# EAGLE design schematic (EAGLE 8.2.2)
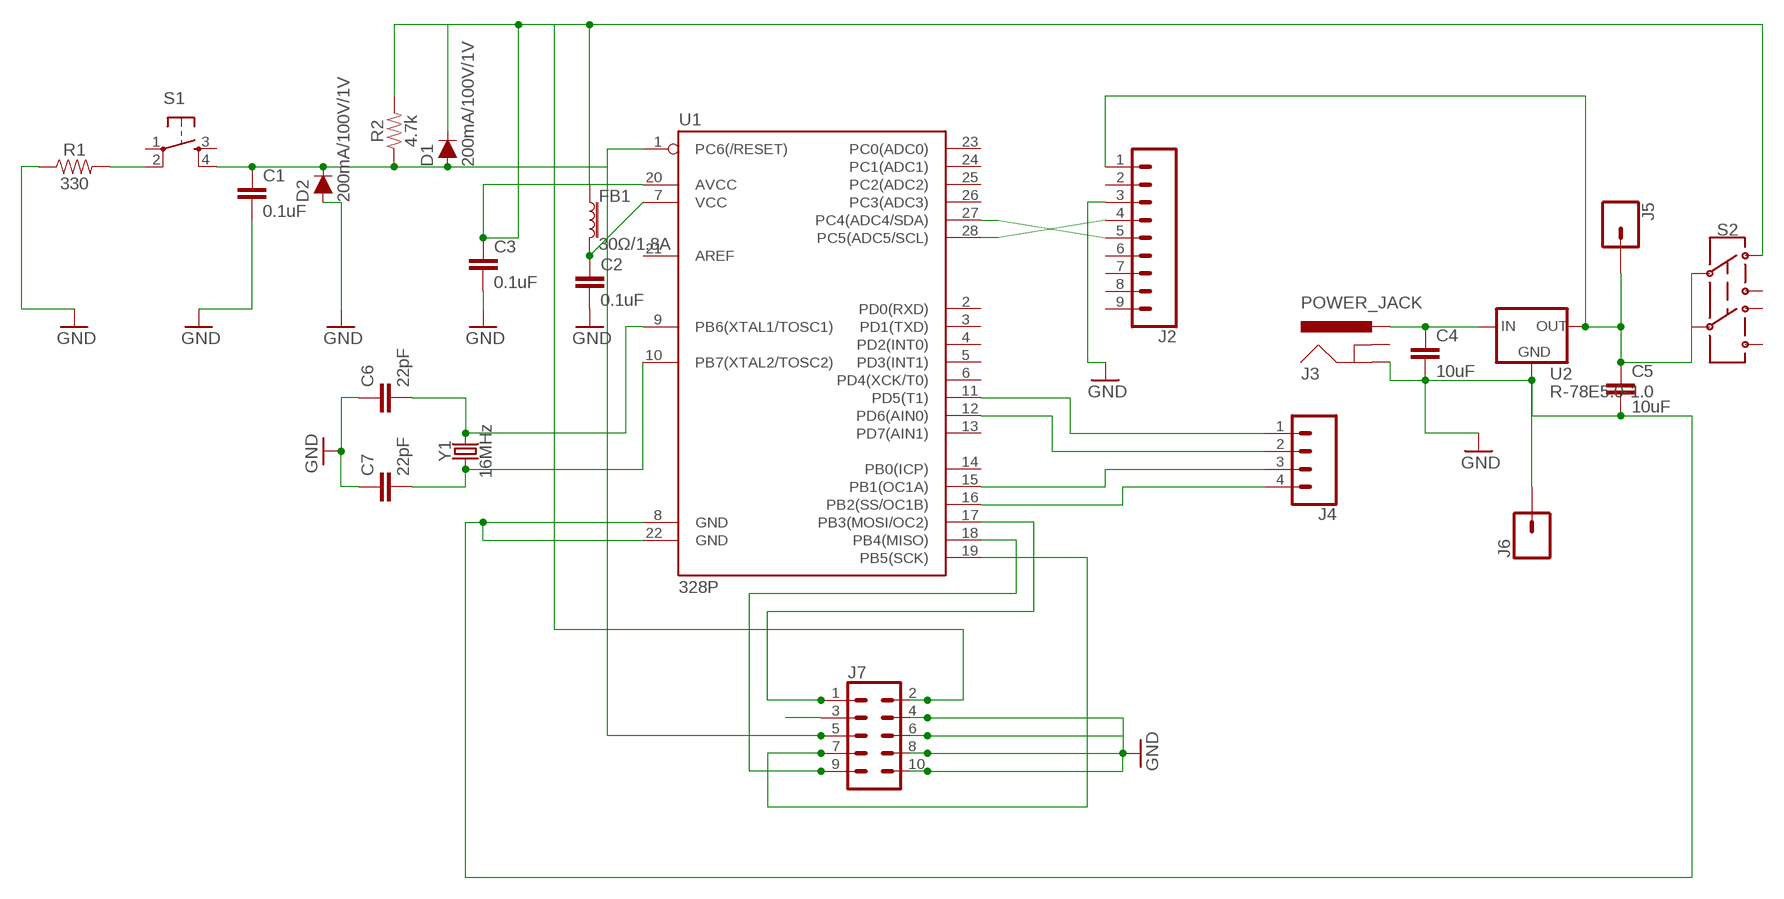
[diagram p0: schematic, sheet 1]

## Parts
C1  0.1uF  0.1UF-0603-25V-(+80/-20%)  [0603]
C2  0.1uF  0.1UF-0603-25V-(+80/-20%)  [0603]
C3  0.1uF  0.1UF-0603-25V-(+80/-20%)  [0603]
C4  10uF  10UF-0603-6.3V-20%  [0603]
C5  10uF  10UF-0603-6.3V-20%  [0603]
C6  22pF  22PF-0603-50V-5%  [0603]
C7  22pF  22PF-0603-50V-5%  [0603]
D1  200mA/100V/1V  DIODE-1N4148  [DIODE-1N4148]
D2  200mA/100V/1V  DIODE-1N4148  [DIODE-1N4148]
FB1  30Ω/1.8A  FERRITE_BEAD-0603  [0603]
J2  CONN_09  [1X09]
J3  POWER_JACK  [POWER_JACK_PTH]
J4  CONN_04  [1X04]
J5  CONN_01  [1X01]
J6  CONN_01  [1X01]
J7  CONN_05X2SHD  [2X5-SHROUDED]
R1  330  330OHM-0603-1/10W-1%  [0603]
R2  4.7k  4.7KOHM-0603-1/10W-1%  [0603]
S1  TAC_SWITCHPTH  [TACTILE-PTH]
S2  SWITCH-DPDT-SMD-AYZ0202  [SWITCH_DPDT_SMD_AYZ0202]
U1  328P  ATMEGA328P_PDIP  [DIP28]
U2  R-78E5.0-1.0  [DC-DC_CONVERTER_78XX]
Y1  16MHz  CRYSTAL-16MHZPTH-HC49US  [HC49US]

## Nets
GND: C1.2 C2.2 C3.2 C4.2 C5.2 C6.1 C7.1 D2.A J2.3 J3.GND J6.1 J7.4 J7.6 J7.8 J7.10 R1.1 U1.8(GND) U1.22(GND) U2.GND
N$1: J2.4 U1.28(PC5(ADC5/SCL))
N$2: J2.5 U1.27(PC4(ADC4/SDA))
N$3: J7.9 U1.18(PB4(MISO))
N$4: J7.1 U1.17(PB3(MOSI/OC2))
N$5: C4.1 J3.PWR U2.VIN(IN)
N$6: J7.7 U1.19(PB5(SCK))
N$7: C1.1 D1.A D2.C J7.5 R2.1 S1.4 U1.1(PC6(/RESET))
N$8: R1.2 S1.2
N$9: J4.1 U1.11(PD5(T1))
N$10: C5.1 J2.1 J5.1 S2.2 U2.VOUT(OUT)
N$11: C3.1 D1.C FB1.1 J7.2 R2.2 S2.1 U1.20(AVCC)
N$12: J4.2 U1.12(PD6(AIN0))
N$13: C2.1 FB1.2 U1.7(VCC)
N$14: J4.3 U1.15(PB1(OC1A))
N$15: J4.4 U1.16(PB2(SS/OC1B))
N$16: C6.2 U1.9(PB6(XTAL1/TOSC1)) Y1.2
N$17: C7.2 U1.10(PB7(XTAL2/TOSC2)) Y1.1
N$18: J7.3
Unconnected: J2.2 J2.6 J2.7 J2.8 J2.9 J3.GNDBREAK S1.1 S1.3 S2.3 S2.4 S2.5 S2.6 U1.2(PD0(RXD)) U1.3(PD1(TXD)) U1.4(PD2(INT0)) U1.5(PD3(INT1)) U1.6(PD4(XCK/T0)) U1.13(PD7(AIN1)) U1.14(PB0(ICP)) U1.21(AREF) U1.23(PC0(ADC0)) U1.24(PC1(ADC1)) U1.25(PC2(ADC2)) U1.26(PC3(ADC3))

## Library data of the parts
C1-C3 = SparkFun-Capacitors:0.1UF: 0.1µF ceramic capacitors A capacitor is a passive two-terminal electrical component used to store electrical energy temporarily in an electric field.; PROD_ID: CAP-00810
C4 C5 = SparkFun-Capacitors:10UF: 10.0µF ceramic capacitors A capacitor is a passive two-terminal electrical component used to store electrical energy temporarily in an electric field.; PROD_ID: CAP-11015
C6 C7 = SparkFun-Capacitors:22PF: 22pF ceramic capacitors A capacitor is a passive two-terminal electrical component used to store electrical energy temporarily in an electric field.; PROD_ID: CAP-07876
D1 D2 = SparkFun-DiscreteSemi:DIODE: Diode These are standard reverse protection diodes and small signal diodes. SparkFun Products: SparkFun SparkPunk Sound Kit <https://www.sparkfun.com/products/11177> SparkFun ESP8266 Thing <https://www.sparkfun.com/products/13231>; PROD_ID: DIO-08378
FB1 = SparkFun-Coils:FERRITE_BEAD: Ferrite Bead (blocks, cores, rings, chokes, etc.) Inductor with layers of ferrite used to suppress high frequencies. Often used to isolate high frequency noise. SparkFun Products: IOIO-OTG - V2.2 <https://www.sparkfun.com/products/13613> SparkFun SAMD21 Mini Breakout <https://www.sparkfun.com/products/13664> SparkFun 6 Degrees of Freedom Breakout - LSM6DS3 <https://www.sparkfun.com/products/13339> SparkFun SAMD21 Dev Breakout <https://www.sparkfun.com/products/13672>; PROD_ID: NDUC-07859
J2 = SparkFun-Connectors:CONN_09: Multi connection point. Often used as Generic Header-pin footprint for 0.1 inch spaced/style header connections On any of the 0.1 inch spaced packages, you can populate with these: Break Away Headers - Straight <https://www.sparkfun.com/products/116> (PRT-00116) Break Away Male Headers - Right Angle <https://www.sparkfun.com/products/553> (PRT-00553) Female Headers <https://www.sparkfun.com/products/115> (PRT-00115) Break Away Headers - Machine Pin <https://www.sparkfun.com/products/117> (PRT-00117) Break Away Female Headers - Swiss Machine Pin <https://www.sparkfun.com/products/743> (PRT-00743) For SCREWTERMINALS and SPRING TERMINALS visit here: Screw Terimnals on SparkFun.com <https://www.sparkfun.com/search/results?term=Screw+Terminals> (5mm/3.5mm/2.54mm spacing) This device is also useful as a general connection point to wire up your design to another part of your project. Our various solder wires solder well into these plated through hole pads. Hook-Up Wire - Assortment (Stranded, 22 AWG) <https://www.sparkfun.com/products/11375> (PRT-11375) Hook-Up Wire - Assortment (Solid Core, 22 AWG) <https://www.sparkfun.com/products/11367> (PRT-11367) View the entire wire category on our website here <https://www.sparkfun.com/categories/141> Special notes: Molex polarized connector foot print use with SKU : PRT-08231 with associated crimp pins and housings. 1MM SMD Version SKU: PRT-10208 NOTES ON THE VARIANTS LOCK and LOCK_LONGPADS... This footprint was designed to help hold the alignment of a through-hole component (i.e. 6-pin header) while soldering it into place. You may notice that each hole has been shifted either up or down by 0.005 of an inch from it's more standard position (which is a perfectly straight line). This slight alteration caused the pins (the squares in the middle) to touch the edges of the holes. Because they are alternating, it causes a "brace" to hold the component in place. 0.005 has proven to be the perfect amount of "off-center" position when using our standard breakaway headers. Although looks a little odd when you look at the bare footprint, once you have a header in there, the alteration is very hard to notice. Also,if you push a header all the way into place, it is covered up entirely on the bottom side.
J3 = SparkFun-Connectors:POWER_JACK: Power Jack Connector This is the standard 5.5mm barrel jack for power. The PTH is the most common, proven, reliable, footprint. The Slot footprint only works if the mill layer is transmitted to the PCB fab house so be warned. Here are the connectors we sell at SparkFun: DC Barrel Power Jack/Connector <https://www.sparkfun.com/products/119> (PRT-00119) DC Barrel Power Jack/Connector (SMD) <https://www.sparkfun.com/products/12748> (PRT-12748) DC Barrel Jack Adapter - Breadboard Compatible <https://www.sparkfun.com/products/10811> (PRT-10811) It is used on this SparkFun product (and many, many others): SparkFun RedBoard - Programmed with Arduino <https://www.sparkfun.com/products/12757> (DEV-12757) Also, if you need a mating power supply or connector, please check these out: Wall Adapter Power Supply - 9VDC 650mA <https://www.sparkfun.com/products/298> (TOL-00298) DC Barrel Jack Adapter - Male <https://www.sparkfun.com/products/10287> (PRT-10287); PROD_ID: CONN-08197
J4 = SparkFun-Connectors:CONN_04: Multi connection point. Often used as Generic Header-pin footprint for 0.1 inch spaced/style header connections On any of the 0.1 inch spaced packages, you can populate with these: Break Away Headers - Straight <https://www.sparkfun.com/products/116> (PRT-00116) Break Away Male Headers - Right Angle <https://www.sparkfun.com/products/553> (PRT-00553) Female Headers <https://www.sparkfun.com/products/115> (PRT-00115) Break Away Headers - Machine Pin <https://www.sparkfun.com/products/117> (PRT-00117) Break Away Female Headers - Swiss Machine Pin <https://www.sparkfun.com/products/743> (PRT-00743) For SCREWTERMINALS and SPRING TERMINALS visit here: Screw Terimnals on SparkFun.com <https://www.sparkfun.com/search/results?term=Screw+Terminals> (5mm/3.5mm/2.54mm spacing) This device is also useful as a general connection point to wire up your design to another part of your project. Our various solder wires solder well into these plated through hole pads. Hook-Up Wire - Assortment (Stranded, 22 AWG) <https://www.sparkfun.com/products/11375> (PRT-11375) Hook-Up Wire - Assortment (Solid Core, 22 AWG) <https://www.sparkfun.com/products/11367> (PRT-11367) View the entire wire category on our website here <https://www.sparkfun.com/categories/141> Special notes: Molex polarized connector foot print use with SKU : PRT-08231 with associated crimp pins and housings. 1MM SMD Version SKU: PRT-10208; PROD_ID: CONN-09696
J5 J6 = SparkFun-Connectors:CONN_01: Single connection point. Often used as Generic Header-pin footprint for 0.1 inch spaced/style header connections On any of the 0.1 inch spaced packages, you can populate with these: Break Away Headers - Straight <https://www.sparkfun.com/products/116> (PRT-00116) Break Away Male Headers - Right Angle <https://www.sparkfun.com/products/553> (PRT-00553) Female Headers <https://www.sparkfun.com/products/115> (PRT-00115) Break Away Headers - Machine Pin <https://www.sparkfun.com/products/117> (PRT-00117) Break Away Female Headers - Swiss Machine Pin <https://www.sparkfun.com/products/743> (PRT-00743) This device is also useful as a general connection point to wire up your design to another part of your project. Our various solder wires solder well into these plated through hole pads. Hook-Up Wire - Assortment (Stranded, 22 AWG) <https://www.sparkfun.com/products/11375> (PRT-11375) Hook-Up Wire - Assortment (Solid Core, 22 AWG) <https://www.sparkfun.com/products/11367> (PRT-11367) View the entire wire category on our website here <https://www.sparkfun.com/categories/141> Special notes: SMTSO-256-ET is a "flush mount" nut for a 4-40 screw. We mostly use this on specialty testbeds; it is a nice way to connect hardware to your PCB at an adjustable hieght. Also note, the SNAP packages are for using a snappable style connector. We sell a baggie of snaps and they are also used on two LilyPad designs: Snap Assortment - 30 pack (male and female) <https://www.sparkfun.com/products/11347> (DEV-11347) LilyPad Arduino SimpleSnap <https://www.sparkfun.com/products/10941> (DEV-10941) LilyPad SimpleSnap Protoboard <https://www.sparkfun.com/products/10940> (DEV-10940)
J7 = SparkFun-Connectors:CONN_05X2: Multi connection point. Often used as Generic Header-pin footprint for 0.1 inch spaced/style header connections For AVR SPI programming port, see special device with nice symbol: "AVR_SPI_PROG_5x2.dev" You can populate with any combo of single row headers, but if you'd like an exact match, check these: 2x5 AVR ICSP Male Header <https://www.sparkfun.com/products/778> (PRT-00778) 2x5 Pin Shrouded Header <https://www.sparkfun.com/products/8506> (PRT-08506) On any of the 0.1 inch spaced packages, you can populate with these: Break Away Headers - Straight <https://www.sparkfun.com/products/116> (PRT-00116) Break Away Male Headers - Right Angle <https://www.sparkfun.com/products/553> (PRT-00553) Female Headers <https://www.sparkfun.com/products/115> (PRT-00115) Break Away Headers - Machine Pin <https://www.sparkfun.com/products/117> (PRT-00117) Break Away Female Headers - Swiss Machine Pin <https://www.sparkfun.com/products/743> (PRT-00743) Special note: the shrouded connector mates well with our 5x2 ribbon cables: 2x5 Pin IDC Ribbon Cable <https://www.sparkfun.com/products/8535> (PRT-08535); PROD_ID: CONN-08671; SF_ID: PRT-08506
R1 = SparkFun-Resistors:330OHM: 330Ω resistor A resistor is a passive two-terminal electrical component that implements electrical resistance as a circuit element. Resistors act to reduce current flow, and, at the same time, act to lower voltage levels within circuits. - Wikipedia; PROD_ID: RES-00818
R2 = SparkFun-Resistors:4.7KOHM: 4.7kΩ resistor A resistor is a passive two-terminal electrical component that implements electrical resistance as a circuit element. Resistors act to reduce current flow, and, at the same time, act to lower voltage levels within circuits. - Wikipedia; PROD_ID: RES-07857
S1 = SparkFun-Retired:TAC_SWITCH: Momentary Switch Button commonly used for reset or general input. Spark Fun Electronics SKU : COM-00097 SMT- SWCH-08247
S2 = SparkFun-Switches:SWITCH-DPDT: Double-Pole, Double-Throw (DPDT) Switch Double-pole, double-throw switches. Variant Overview PTH-GPI-152-3013 Used on SparkFun Geiger Counter <https://www.sparkfun.com/products/11345> SMD-AY0202 Surface Mount DPDT Switch <https://www.sparkfun.com/products/597> (COM-00597) Used on e.g. LilyPad Arduino USB - ATmega32U4 Board <https://www.sparkfun.com/products/12049>; PROD_ID: SWCH-08179; SF_SKU: COM-00597
U1 = SparkFun-IC-Microcontroller:ATMEGA328P_PDIP: Atmel 328P Through hole ATMEGA328P uC used in the Arduino 32kb flash, 1k EEPROM, 2k SRAM Datasheet <http://www.sparkfun.com/datasheets/Components/SMD/ATMega328.pdf> SparkFun Products Storefront component: AVR 28 Pin 20MHz 32K 6A/D - ATMega328P <https://www.sparkfun.com/products/9061> (COM-09061) SparkFun Simon Says - Through-Hole Soldering Kit <https://www.sparkfun.com/products/10547> (KIT-10547) SparkFun Learn to Solder - Simon Says <https://www.sparkfun.com/products/13708> (KIT-13708) SparkFun BigTime Watch Kit <https://www.sparkfun.com/products/11734> (KIT-11734) SparkFun ClockIt <https://www.sparkfun.com/products/10930> (KIT-10930) SparkFun Serial Enabled LCD Kit <https://www.sparkfun.com/products/10097> (LCD-10097) SparkFun Simon Tilts - Through Hole Soldering Kit <https://www.sparkfun.com/products/12634> (KIT-12634) SparkFun Frequency Counter Kit <https://www.sparkfun.com/products/10140> (KIT-10140) FabFM Radio Kit <https://www.sparkfun.com/products/11043> (KIT-11043) SparkFun Binary Blaster Kit <https://www.sparkfun.com/products/12037> (KIT-12037) SparkFun Metro-Gnome <https://www.sparkfun.com/products/9236> (KIT-09236) ATmega328 with Arduino Optiboot (Uno) <https://www.sparkfun.com/products/10524> (DEV-10524); PROD_ID: IC-09136
U2 = SparkFun-IC-Power:R-78E5.0-1.0: Recom Power 5V 1A DC/DC Converter The Recom R-78E5.0-X.X is a compact DC/DC converter module that is a pin for pin drop-in replacement for the LM7805 linear voltage regulator. Specifications: Input Range: 7-28V Output Voltage: 5V Output Current: 1A Max Efficiency: 91% Datasheet <https://www.recom-power.com/pdf/Innoline/R-78Exx-1.0.pdf>; PROD_ID: COM-13655
Y1 = SparkFun-Clocks:CRYSTAL-16MHZ: 16MHz Crystal Digikey Example <http://www.digikey.com/product-search/en?keywords=535-9122-1-ND> Frequency: 16MHz Frequency Stability: ±50ppm Frequency Tolerance: ±20ppm Load Capacitance: 18pF SparkFun Products: Pro Micro -5V/16MHz <https://www.sparkfun.com/products/12640> SparkFun Serial Enabled LCD Kit <https://www.sparkfun.com/products/10097>; PROD_ID: XTAL-08181; SF_ID: COM-00536

## Board
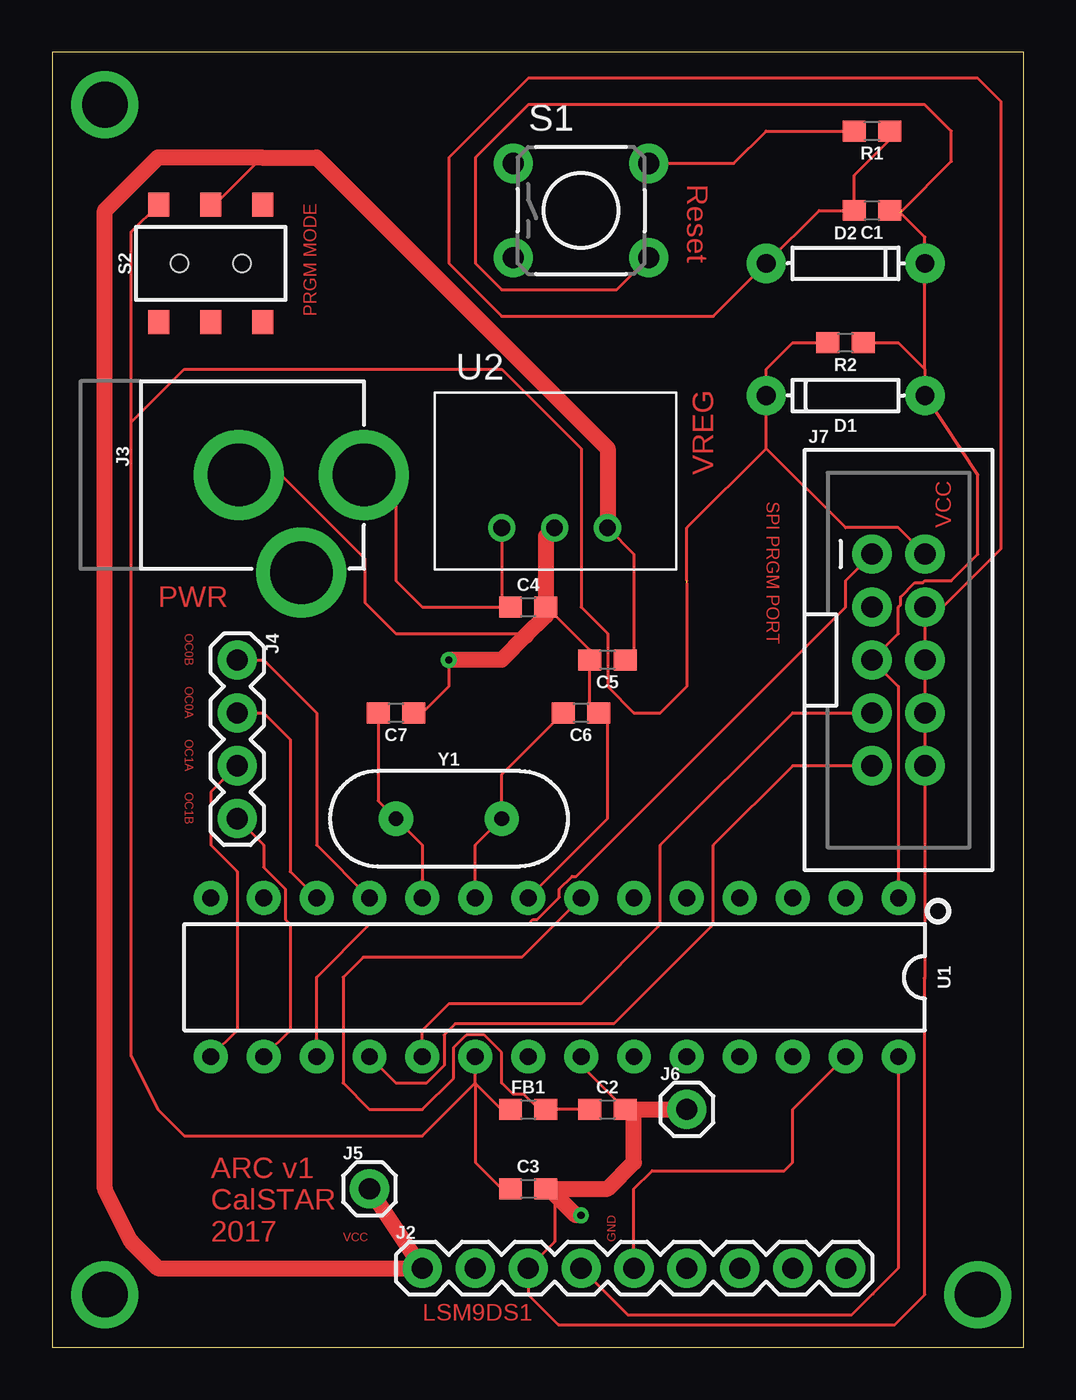
[diagram p1: board, top side]
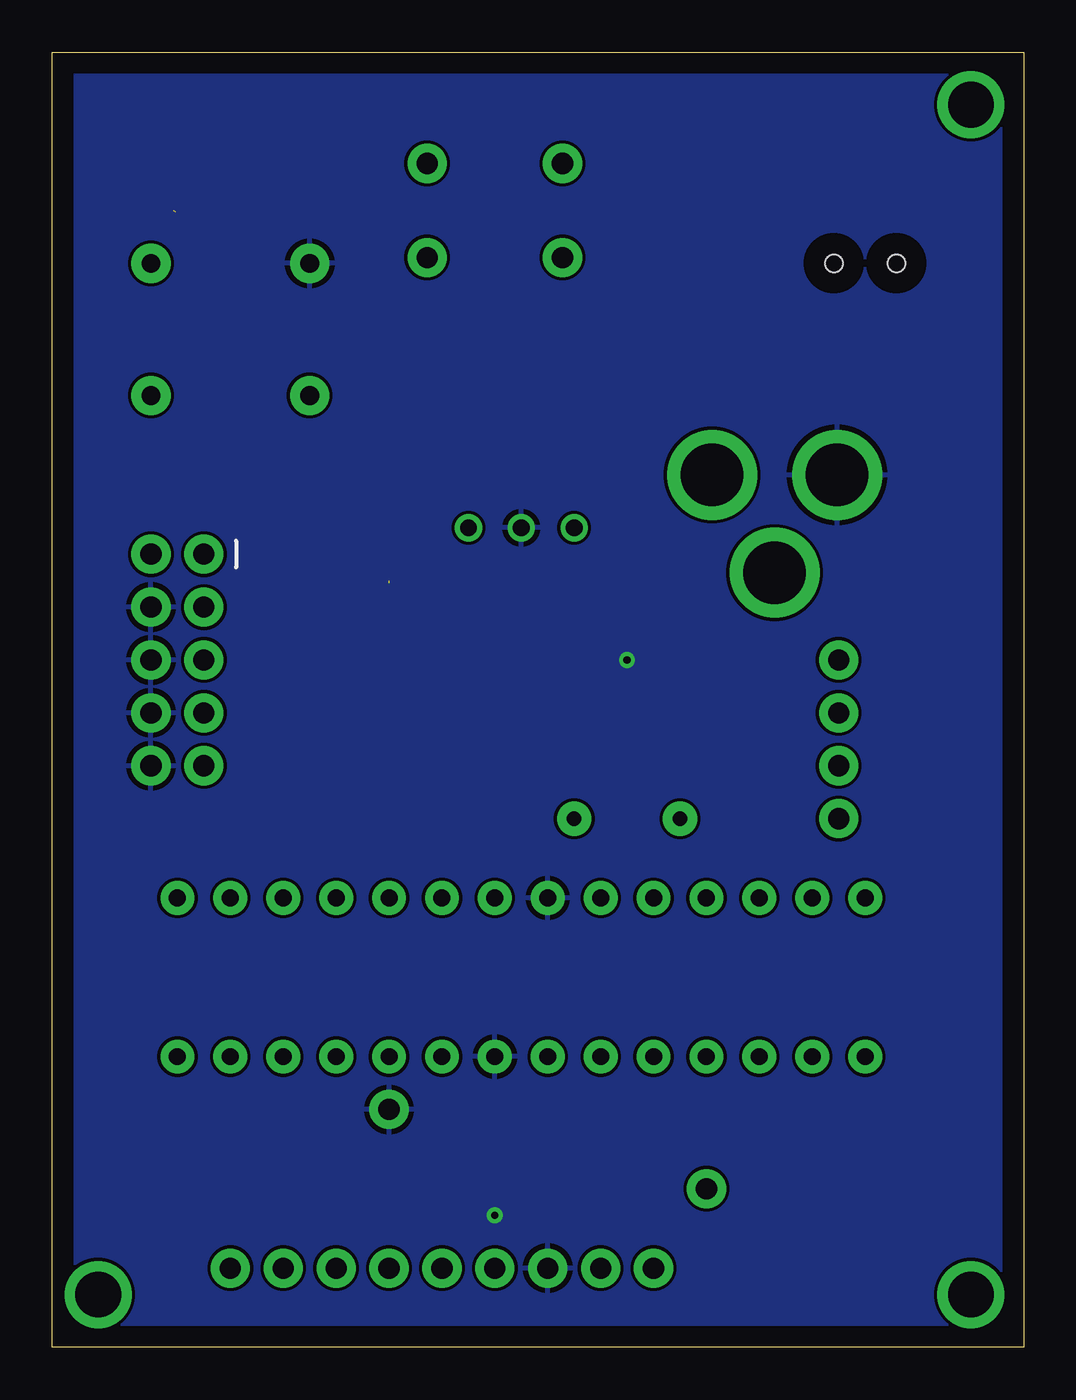
[diagram p2: board, bottom side, seen from below]

Size 46.66 x 62.22 mm. Coordinates in mm from the lower left corner, seen from the top.
Outline: 0,0 46.66,0 46.66,62.22 0,62.22 0,0
Copper layers (1*16): Top 0.035mm / dielectric 1.5mm / Bottom 0.035mm
Design rules "default": minimum track width 6mil, minimum drill 0.35mm, track to track 6mil, track to pad 6mil, pad to pad 6mil, via to via 6mil, smd to smd 6mil, copper to edge 40mil, drill to drill 6mil, minimum pad ring 10mil, minimum via ring 8mil, stop-mask expansion 4mil, vias tented up to drill 0mil, thermal gap 10mil

### Footprints (pad centres in the part's own frame; a part is rotated, then mirrored left to right if it is on the bottom)
0603 = smd 1.1 x 1: 1 -0.85,0; 2 0.85,0
DIODE-1N4148 = drill 0.9 pad 1.88: A -3.81,0; C 3.81,0
1X09 = drill 1.016 pad 1.88: 1 0,0; 2 2.54,0; 3 5.08,0; 4 7.62,0; 5 10.16,0; 6 12.7,0; 7 15.24,0; 8 17.78,0; 9 20.32,0
POWER_JACK_PTH = drill 2.997 pad 4.318: GND 0,7.7; GNDBREAK 4.7,10.7; PWR 0,13.7
1X04 = drill 1.016 pad 1.88: 1 0,0; 2 2.54,0; 3 5.08,0; 4 7.62,0
1X01 = drill 1.016 pad 1.88: 1 0,0
2X5-SHROUDED = drill 1.016 pad 1.88: 1 -1.27,5.08; 2 1.27,5.08; 3 -1.27,2.54; 4 1.27,2.54; 5 -1.27,0; 6 1.27,0; 7 -1.27,-2.54; 8 1.27,-2.54; 9 -1.27,-5.08; 10 1.27,-5.08
TACTILE-PTH = drill 1.016 pad 1.88: 1 -3.251,2.261; 2 3.251,2.261; 3 -3.251,-2.261; 4 3.251,-2.261
SWITCH_DPDT_SMD_AYZ0202 = smd 1 x 1.15: 1 -2.5,2.825; 2 0,2.825; 3 2.5,2.825; 4 -2.5,-2.825; 5 0,-2.825; 6 2.5,-2.825 | hole 0.85: 1.5,0; -1.5,0
DIP28 = drill 0.813 pad 1.626: 1 -16.51,-3.81; 2 -13.97,-3.81; 3 -11.43,-3.81; 4 -8.89,-3.81; 5 -6.35,-3.81; 6 -3.81,-3.81; 7 -1.27,-3.81; 8 1.27,-3.81; 9 3.81,-3.81; 10 6.35,-3.81; 11 8.89,-3.81; 12 11.43,-3.81; 13 13.97,-3.81; 14 16.51,-3.81; 15 16.51,3.81; 16 13.97,3.81; 17 11.43,3.81; 18 8.89,3.81; 19 6.35,3.81; 20 3.81,3.81; 21 1.27,3.81; 22 -1.27,3.81; 23 -3.81,3.81; 24 -6.35,3.81; 25 -8.89,3.81; 26 -11.43,3.81; 27 -13.97,3.81; 28 -16.51,3.81
DC-DC_CONVERTER_78XX = drill 0.8: GND 0,0; VIN -2.54,0; VOUT 2.54,0
HC49US = drill 0.7 pad 1.651: 1 -2.54,0; 2 2.54,0

### Placement (x,y rotation side)
C1  39.37,54.61 180 top
C2  26.67,11.43 0 top
C3  22.86,7.62 0 top
C4  22.86,35.56 0 top
C5  26.67,33.02 180 top
C6  25.4,30.48 180 top
C7  16.51,30.48 180 top
D1  38.1,45.72 180 top
D2  38.1,52.07 0 top
FB1  22.86,11.43 0 top
J2  17.78,3.81 0 top
J3  1.27,41.91 270 top
J4  8.89,33.02 270 top
J5  15.24,7.62 0 top
J6  30.48,11.43 0 top
J7  40.64,33.02 0 top
R1  39.37,58.42 180 top
R2  38.1,48.26 180 top
S1  25.4,54.61 0 top
S2  7.62,52.07 0 top
U1  24.13,17.78 180 top
U2  24.13,39.37 0 top
Y1  19.05,25.4 0 top

### Tracks (layer width: path | path; a pad name or v marks a point on that pad's centre or on a via)
GND  (via drill 0.35)
  Top 0.152: R1.1 40.22,58 38.52,56.3 C1.2 36.83,54.61 D2.A 31.75,49.53 21.59,49.53 19.05,52.07 19.05,57.15 22.86,60.96 44.45,60.96 45.57,59.84 45.57,38.37 42.76,35.56 J7.4 J7.6 J7.8 J7.10 41.91,17.78 41.88,17.75 41.91,17.71 41.91,2.54 40.46,1.09 24.31,1.09 22.86,2.54 J2.3 24.13,5.08 24.13,7.2 C3.2 23.88,7.62 | 17.78,30.9 C7.1 17.78,30.48 19.05,31.75 v19.05,33.02 | C2.2 27.94,11.01 | C2.2 27.64,11.43 27.94,11.13 | U1.8 26.67,25.4 26.67,30.06 C6.1 25.82,30.91 C5.2 25.82,33.5 23.71,35.61 C4.2 23.71,35.14 23.71,35.07 | J3.GND 11,41.91 15.02,37.88 15.02,35.78 16.51,34.29 22.65,34.29 22.75,34.18 | U1.22 25.4,13.55 C2.2 | v25.4,6.35 25.15,6.35
  Top 0.762: 27.64,11.43 J6.1 | 23.71,35.61 23.71,38.95 U2.GND | 23.71,35.14 22.75,34.18 21.59,33.02 v19.05,33.02 | 27.94,11.13 27.94,8.89 26.67,7.62 23.88,7.62 25.15,6.35
  pour Bottom: 0,62.23 45.72,62.23 46.99,62.23 46.99,0 0,0
N$1
  Top 0.152: 39.41,2.58 40.64,3.81 U1.28 | 39.41,2.58 39.37,2.54 | 39.41,2.58 38.41,1.57 27.64,1.57 J2.4
N$2
  Top 0.152: J2.5 27.94,7.62 28.81,8.49 35.16,8.49 35.56,8.89 35.56,11.43 U1.27
N$3
  Top 0.152: U1.18 16.51,12.7 17.98,12.7 18.82,13.54 18.82,15.01 19.36,15.54 26.98,15.54 31.75,20.32 31.75,24.13 35.56,27.94 J7.9
N$4
  Top 0.152: U1.17 12.7,17.78 15.24,20.32 22.86,20.32 23.09,20.55 23.29,20.55 24.36,21.62 24.36,22.02 24.97,22.63 25.17,22.63 38.1,35.56 38.1,36.83 J7.1
N$5
  Top 0.152: U2.VIN 21.59,35.98 C4.1 17.78,35.56 16.51,36.83 16.51,40.64 15.24,41.91 J3.PWR
N$6
  Top 0.152: U1.19 17.78,15.24 19.05,16.51 25.4,16.51 29.21,20.32 29.21,24.13 35.56,30.48 J7.7
N$7  (1 unrouted)
  Top 0.152: 40.73,54.52 40.64,54.61 41.91,53.34 D2.C 41.91,46.99 | 40.64,45.72 D1.A 41.97,45.64 | S1.4 27.1,50.8 21.59,50.8 20.32,52.07 20.32,57.15 22.86,59.69 41.91,59.69 43.18,58.42 43.18,56.97 40.82,54.61 C1.1 | U1.1 40.64,31.75 J7.5 40.64,34.29 40.64,35.56 40.74,35.66 40.74,36.04 41.43,36.73 41.81,36.73 41.91,36.83 43.18,36.83 44.45,38.1 44.45,41.91 41.97,45.64 | R2.1 40.64,48.26 41.91,46.99 | 41.91,46.99 41.91,45.69 41.97,45.64
N$8
  Top 0.152: R1.2 34.29,58.42 32.74,56.87 S1.2
N$9
  Top 0.152: J4.1 10.16,33.02 12.7,30.48 12.7,24.13 U1.11
N$10
  Top 0.152: U2.VOUT 27.94,38.1 27.94,33.44 C5.1 | 5.08,57.15 5.37,57.15 | S2.2 7.8,54.89 10.06,57.15
  Top 0.762: J5.1 J2.1 5.08,3.81 3.81,5.08 2.54,7.62 2.54,54.61 5.08,57.15 10.06,57.15 12.7,57.15 26.67,43.18 U2.VOUT
N$11  (1 unrouted)
  Top 0.152: 3.81,44.45 6.35,46.99 21.59,46.99 25.4,43.18 25.4,35.56 26.67,34.29 26.67,31.75 27.94,30.48 29.21,30.48 30.48,31.75 30.48,36.71 | 3.81,44.45 3.81,13.97 5.08,11.43 6.35,10.16 17.78,10.16 20.32,12.7 | S2.1 3.81,53.58 3.81,44.45 | 20.32,13.12 U1.20 20.32,12.7 | 30.48,36.83 30.48,39.37 34.29,43.18 | 20.32,12.68 20.32,12.7 | 20.32,12.68 20.32,8.89 21.59,7.62 C3.1 | FB1.1 21.57,11.43 20.32,12.68 | J7.2 40.64,39.37 38.1,39.37 34.29,43.18 | R2.2 35.56,48.26 34.29,46.99 D1.C 34.29,43.18
N$12
  Top 0.152: J4.2 10.16,30.48 11.43,29.21 11.43,22.86 U1.12
N$13
  Top 0.152: C2.1 FB1.2 23.38,11.43 22.66,12.16 22.13,12.16 21.59,12.7 21.59,14.17 20.75,15.01 19.89,15.01 19.28,14.4 19.28,12.93 17.78,11.43 15.24,11.43 13.97,12.7 13.97,17.78 14.94,18.74 22.55,18.74 U1.7
N$14
  Top 0.152: J4.3 7.62,26.67 7.62,24.13 8.89,22.86 8.89,15.24 U1.15
N$15
  Top 0.152: J4.4 10.16,24.13 10.16,23.06 11.2,22.02 11.2,20.55 11.43,20.32 11.43,15.24 U1.16
N$16
  Top 0.152: U1.9 20.32,24.13 Y1.2 21.59,27.52 C6.2
N$17
  Top 0.152: C7.2 15.66,26.25 Y1.1 17.78,24.13 U1.10
N$19  (via drill 2.2)
  other vias: 2.54,59.69
N$20  (via drill 2.2)
  other vias: 2.54,2.54
N$21  (via drill 2.2)
  other vias: 44.45,2.54

### Text on the board
Top: Reset | PRGM MODE | VREG | SPI PRGM PORT | VCC | PWR | OC0B | OC0A | OC1A | OC1B | GND | ARC v1 / CalSTAR / 2017 | VCC | LSM9DS1